# EAGLE design multimeter (EAGLE 6.5.0)
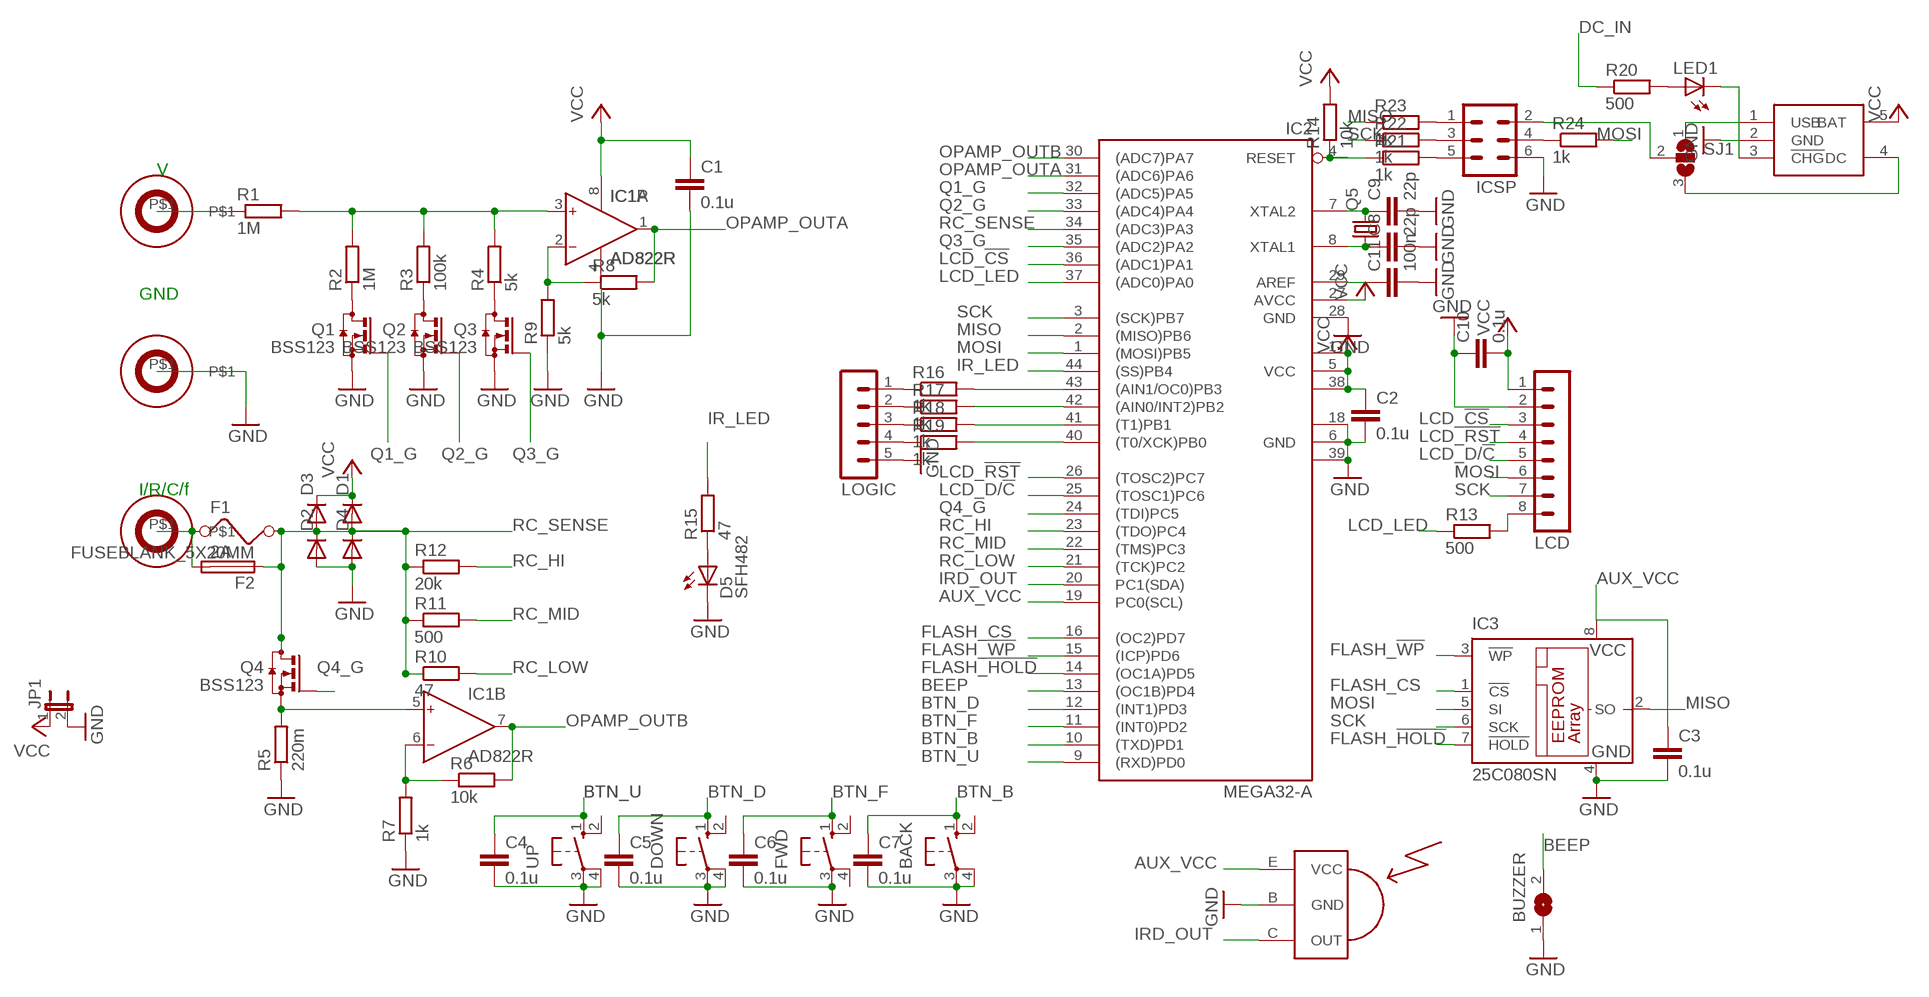
[diagram p0: schematic, sheet 1]

## Parts
BACK  10-XX  [B3F-10XX]
BUZZER  SJW  [SJW]
C1  0.1u  C-EUC0805  [C0805]
C2  0.1u  C-EUC0805  [C0805]
C3  0.1u  C-EUC0805  [C0805]
C4  0.1u  C-EUC0805  [C0805]
C5  0.1u  C-EUC0805  [C0805]
C6  0.1u  C-EUC0805  [C0805]
C7  0.1u  C-EUC0805  [C0805]
C8  22p  C-EUC0603  [C0603]
C9  22p  C-EUC0603  [C0603]
C10  0.1u  C-EUC0805  [C0805]
C11  100n  C-EUC0805  [C0805]
D1  DIODE-SOD123  [SOD123]
D2  DIODE-SOD123  [SOD123]
D3  DIODE-SOD123  [SOD123]
D4  DIODE-SOD123  [SOD123]
D5  SFH482  [SFH482]
DOWN  10-XX  [B3F-10XX]
F1  2A  FUSE'1206'  [R1206]
F2  FUSEBLANK_5X20MM  [FUSE_HOLDER_5X20MM]
FWD  10-XX  [B3F-10XX]
IC1  AD822R  [SO8]
IC2  MEGA32-A  [TQFP44]
IC3  25C080SN  [SO-08]
ICSP  MA03-2  [MA03-2]
JP1  JP1E  [JP1]
LCD  MA08-1  [MA08-1]
LED1  LEDSML0805  [SML0805]
LOGIC  MA05-1  [MA05-1]
N$36  BINDINGPOST4MMPCB  [BINDINGPOSTPCB]
Q1  BSS123  [SOT23]
Q2  BSS123  [SOT23]
Q3  BSS123  [SOT23]
Q4  BSS123  [SOT23]
Q5  CRYSTALHC49UP  [HC49UP]
R1  1M  R-EU_0207/12  [0207/12]
R2  1M  R-EU_R0805  [R0805]
R3  100k  R-EU_R0805  [R0805]
R4  5k  R-EU_R0805  [R0805]
R5  220m  R-EU_R1206  [R1206]
R6  10k  R-EU_R0805  [R0805]
R7  1k  R-EU_R0805  [R0805]
R8  5k  R-EU_R0805  [R0805]
R9  5k  R-EU_R0805  [R0805]
R10  47  R-EU_R0805  [R0805]
R11  500  R-EU_R0805  [R0805]
R12  20k  R-EU_R0805  [R0805]
R13  500  R-EU_R0805  [R0805]
R14  10k  R-EU_R0805  [R0805]
R15  47  R-EU_R0805  [R0805]
R16  1k  R-EU_R0805  [R0805]
R17  1k  R-EU_R0805  [R0805]
R18  1k  R-EU_R0805  [R0805]
R19  1k  R-EU_R0805  [R0805]
R20  500  R-EU_R0805  [R0805]
R21  1k  R-EU_R0805  [R0805]
R22  1k  R-EU_R0805  [R0805]
R23  1k  R-EU_R0805  [R0805]
R24  1k  R-EU_R0805  [R0805]
SJ1  SJ2W  [SJ_2]
U$1  BINDINGPOST4MMPCB  [BINDINGPOSTPCB]
U$2  BINDINGPOST4MMPCB  [BINDINGPOSTPCB]
U$3  IRDETECTOR  [TO92-EBC]
U$4  LITHIUMCHARGER  [SOT23-5L]
UP  10-XX  [B3F-10XX]

## Nets
AUX_VCC: C3.1 IC2.19(PC0(SCL)) IC3.8(VCC) U$3.E(VCC)
BEEP: BUZZER.2 IC2.13((OC1B)PD4)
BTN_B: BACK.1(S) C7.1 IC2.10((TXD)PD1)
BTN_D: C5.1 DOWN.1(S) IC2.12((INT1)PD3)
BTN_F: C6.1 FWD.1(S) IC2.11((INT0)PD2)
BTN_U: C4.1 IC2.9((RXD)PD0) UP.1(S)
DC_IN: ICSP.2 R20.1 SJ1.2
FLASH_!HOLD: IC2.14((OC1A)PD5) IC3.7(!HOLD)
FLASH_!WP: IC2.15((ICP)PD6) IC3.3(!WP)
FLASH_CS: IC2.16((OC2)PD7) IC3.1(!CS)
GND: BACK.3(P) BACK.4(P1) BUZZER.1 C1.2 C2.2 C3.2 C4.2 C5.2 C6.2 C7.2 C8.2 C9.2 C10.1 C11.2 D2.A D4.A D5.K(C) DOWN.3(P) DOWN.4(P1) FWD.3(P) IC1.4(P:V-) IC2.6(GND) IC2.18(GND1) IC2.28(GND) IC2.39(GND2) IC3.4(GND) ICSP.6 JP1.2 LCD.2 LOGIC.5 Q1.2(S) Q2.2(S) Q3.2(S) R5.1 R7.1 R9.1 U$2.P$1 U$3.B(GND) U$4.2(GND) UP.3(P) UP.4(P1)
IR_LED: IC2.44((SS)PB4) R15.2
IRD_OUT: IC2.20(PC1(SDA)) U$3.C(OUT)
LCD_!CS: IC2.36((ADC1)PA1) LCD.3
LCD_!RST: IC2.26((TOSC2)PC7) LCD.4
LCD_D/!C: IC2.25((TOSC1)PC6) LCD.5
LCD_LED: IC2.37((ADC0)PA0) R13.1
MISO: IC2.2((MISO)PB6) IC3.2(SO) R23.1
MOSI: IC2.1((MOSI)PB5) IC3.5(SI) LCD.6 R24.2
N$1: D5.A R15.1
N$2: Q2.3(D) R3.1
N$3: LOGIC.1 R16.1
N$4: IC1.3(A:IN+) R1.2 R2.2 R3.2 R4.2
N$5: IC1.5(B:IN+) Q4.2(S) R5.2
N$6: LOGIC.2 R17.1
N$7: IC1.6(B:IN-) R6.1 R7.2
N$8: LOGIC.3 R18.1
N$9: IC1.2(A:IN-) R8.1 R9.2
N$10: LOGIC.4 R19.1
N$11: IC2.43((AIN1/OC0)PB3) R16.2
N$12: ICSP.4 R24.1
N$13: IC2.42((AIN0/INT2)PB2) R17.2
N$14: IC2.41((T1)PB1) R18.2
N$15: IC2.40((T0/XCK)PB0) R19.2
N$16: C9.1 IC2.7(XTAL2) Q5.2
N$17: R1.1 U$1.P$1
N$18: C8.1 IC2.8(XTAL1) Q5.1
N$20: SJ1.3 U$4.4(DC)
N$21: IC2.4(RESET) R14.1 R21.1
N$22: SJ1.1 U$4.1(USB)
N$23: LED1.A R20.2
N$24: LED1.C U$4.3(!CHG)
N$25: ICSP.5 R21.2
N$26: ICSP.3 R22.2
N$27: ICSP.1 R23.2
N$28: C11.1 IC2.29(AREF)
N$34: LCD.8 R13.2
N$36: F1.1 F2.2 N$36.P$1
N$40: Q1.3(D) R2.1
N$43: Q3.3(D) R4.1
OPAMP_OUTA: IC1.1(A:OUT) IC2.31((ADC6)PA6) R8.2
OPAMP_OUTB: IC1.7(B:OUT) IC2.30((ADC7)PA7) R6.2
Q1_G: IC2.32((ADC5)PA5) Q1.1(G)
Q2_G: IC2.33((ADC4)PA4) Q2.1(G)
Q3_G: IC2.35((ADC2)PA2) Q3.1(G)
Q4_G: IC2.24((TDI)PC5) Q4.1(G)
RC_HI: IC2.23((TDO)PC4) R12.2
RC_LOW: IC2.21((TCK)PC2) R10.2
RC_MID: IC2.22((TMS)PC3) R11.2
RC_SENSE: D1.A D2.C D3.A D4.C F1.2 F2.1 IC2.34((ADC3)PA3) Q4.3(D) R10.1 R11.1 R12.1
SCK: IC2.3((SCK)PB7) IC3.6(SCK) LCD.7 R22.1
VCC: C1.1 C2.1 C10.2 D1.C D3.C IC1.8(P:V+) IC2.5(VCC) IC2.17(VCC1) IC2.27(AVCC) IC2.38(VCC2) JP1.1 LCD.1 R14.2 U$4.5(BAT)
Unconnected: BACK.2(S1) DOWN.2(S1) FWD.2(S1) FWD.4(P1) UP.2(S1)

## Notes on the sheet
- V
- GND
- I/R/C/f

## Library data of the parts
BACK DOWN FWD UP = switch-omron:10-XX: OMRON SWITCH; MPN: B3F-1000; OC_FARNELL: 176432; OC_NEWARK: 36M3542
BUZZER = jumper:SJ: SMD solder JUMPER
C1-C11 = rcl:C-EU: CAPACITOR, European symbol
D1-D4 = diode:DIODE-: DIODE
D5 = led:SFH482: IR LED infrared emitting diode, Infineon
F1 = myparts:FUSE: FUSE 5 x 20 mm
F2 = fuse:FUSE: Fuse; OC_FARNELL: unknown; OC_NEWARK: unknown
IC1 = analog-devices:AD822: Single-Supply, Rail-to-Rail Low Power FET-Input Op Amp Source: http://www.analog.com/static/imported-files/data_sheets/AD822.pdf; MF: ANALOG DEVICES; MPN: AD822BRZ; OC_FARNELL: 1651303
IC2 = atmel:MEGA32: MICROCONTROLLER 32 Kbytes FLASH 2 Kbytes SRAM 1 Kbytes EEPROM USART 8-channel 10 bit ADC Source: www.atmel.com .. doc2503.pdf; MPN: ATMEGA32-16AU; OC_FARNELL: 9171274; OC_NEWARK: 69K6677
IC3 = microchip:25*: Serial EEPROM 4K/ 8K , SPI bus; MF: MICROCHIP; MPN: 25C080/SN; OC_FARNELL: unknown; OC_NEWARK: 96K4086
ICSP = con-lstb:MA03-2: PIN HEADER; OC_FARNELL: unknown; OC_NEWARK: unknown
JP1 = jumper:JP1E: JUMPER
LCD = con-lstb:MA08-1: PIN HEADER; OC_FARNELL: unknown; OC_NEWARK: unknown
LED1 = led:LED: LED OSRAM: - CHIPLED LG R971, LG N971, LY N971, LG Q971, LY Q971, LO R971, LY R971 LH N974, LH R974 LS Q976, LO Q976, LY Q976 LO Q996 - Hyper CHIPLED LW Q18S LB Q993, LB Q99A, LB R99A - SideLED LS A670, LO A670, LY A670, LG A670, LP A670 LB A673, LV A673, LT A673, LW A673 LH A674 LY A675 LS A676, LA A676, LO A676, LY A676, LW A676 LS A679, LY A679, LG A679 - Hyper Micro SIDELED® LS Y876, LA Y876, LO Y876, LY Y876 LT Y87S - SmartLED LW L88C, LW L88S LB L89C, LB L89S, LG L890 LS L89K, LO L89K, LY L89K LS L896, LA L896, LO L896, LY L896 - TOPLED LS T670, LO T670, LY T670, LG T670, LP T670 LSG T670, LSP T670, LSY T670, LOP T670, LYG T670 LG T671, LOG T671, LSG T671 LB T673, LV T673, LT T673, LW T673 LH T674 LS T676, LA T676, LO T676, LY T676, LB T676, LH T676, LSB T676, LW T676 LB T67C, LV T67C, LT T67C, LS T67K, LO T67K, LY T67K, LW E67C LS E67B, LA E67B, LO E67B, LY E67B, LB E67C, LV E67C, LT E67C LW T67C LS T679, LY T679, LG T679 LS T770, LO T770, LY T770, LG T770, LP T770 LB T773, LV T773, LT T773, LW T773 LH T774 LS E675, LA E675, LY E675, LS T675 LS T776, LA T776, LO T776, LY T776, LB T776 LHGB T686 LT T68C, LB T68C - Hyper Mini TOPLED® LB M676 - Mini TOPLED Santana® LG M470 LS M47K, LO M47K, LY M47K Source: http://www.osram.convergy.de LUXEON: - LUMILED® LXK2-PW12-R00, LXK2-PW12-S00, LXK2-PW14-U00, LXK2-PW14-V00 LXK2-PM12-R00, LXK2-PM12-S00, LXK2-PM14-U00 LXK2-PE12-Q00, LXK2-PE12-R00, LXK2-PE12-S00, LXK2-PE14-T00, LXK2-PE14-U00 LXK2-PB12-K00, LXK2-PB12-L00, LXK2-PB12-M00, LXK2-PB14-N00, LXK2-PB14-P00, LXK2-PB14-Q00 LXK2-PR12-L00, LXK2-PR12-M00, LXK2-PR14-Q00, LXK2-PR14-R00 LXK2-PD12-Q00, LXK2-PD12-R00, LXK2-PD12-S00 LXK2-PH12-R00, LXK2-PH12-S00 LXK2-PL12-P00, LXK2-PL12-Q00, LXK2-PL12-R00 Source: www.luxeon.com KINGBRIGHT: KA-3528ASYC Source: www.kingbright.com
LOGIC = con-lstb:MA05-1: PIN HEADER; OC_FARNELL: unknown; OC_NEWARK: unknown
N$36 U$1 U$2 = myparts:BINDINGPOST
Q1-Q4 = transistor-small-signal:BSS123: N-CHANNEL MOS FET
Q5 = crystal:CRYSTAL: CRYSTAL; OC_FARNELL: unknown; OC_NEWARK: unknown
R1 R6-R24 = rcl:R-EU_: RESISTOR, European symbol
R2-R5 = resistor:R-EU_: RESISTOR, European symbol
SJ1 = jumper:SJ2W: SMD solder JUMPER
U$3 = myparts:IRDETECTOR
U$4 = myparts:LITHIUMCHARGER

## Board
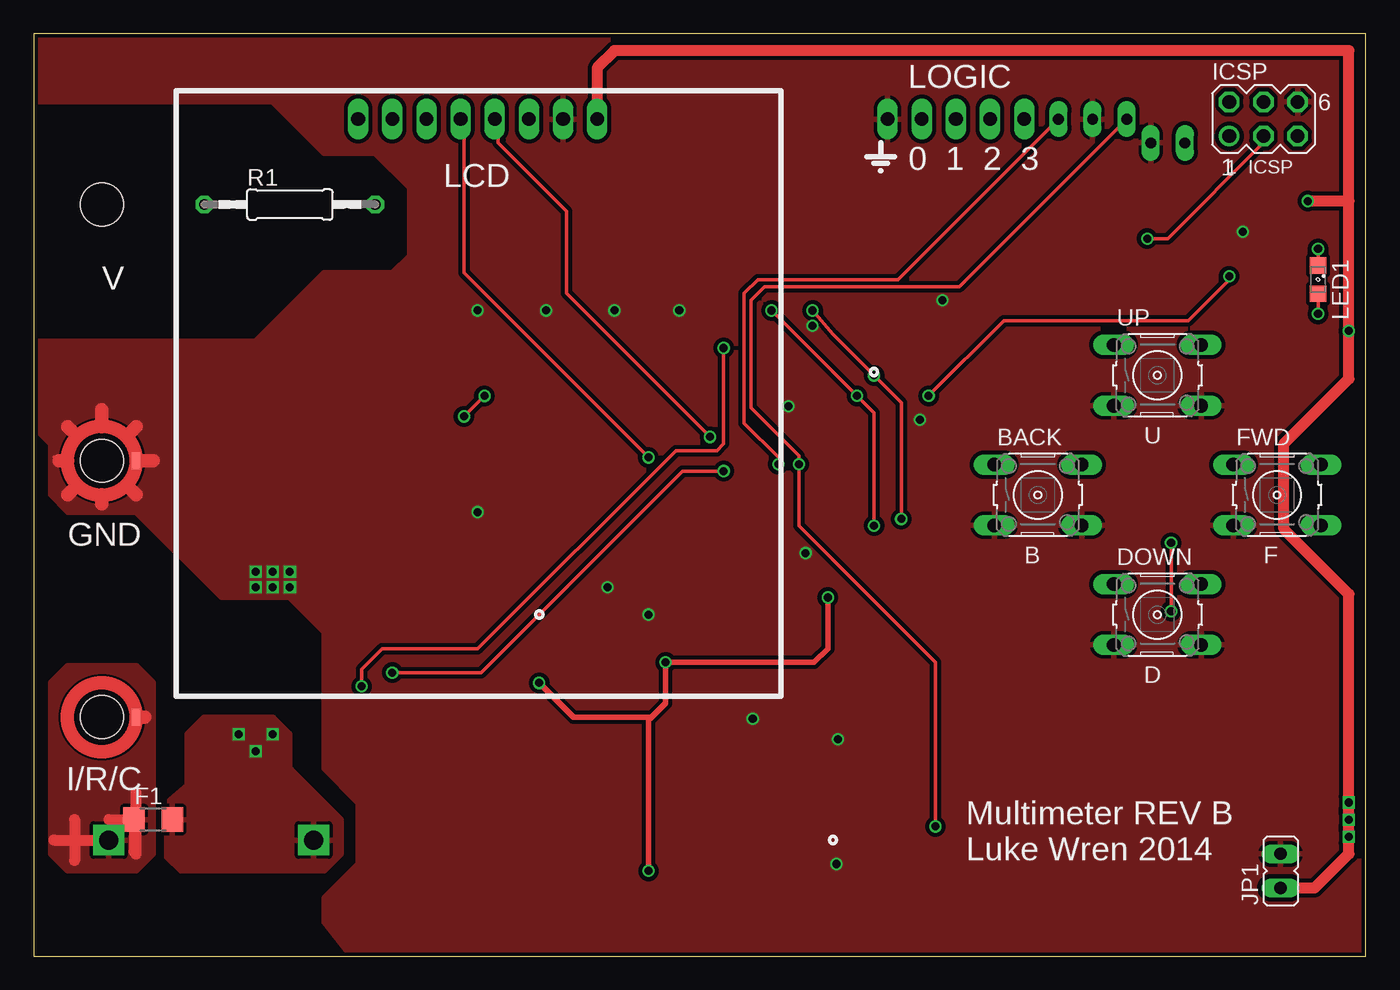
[diagram p1: board, top side]
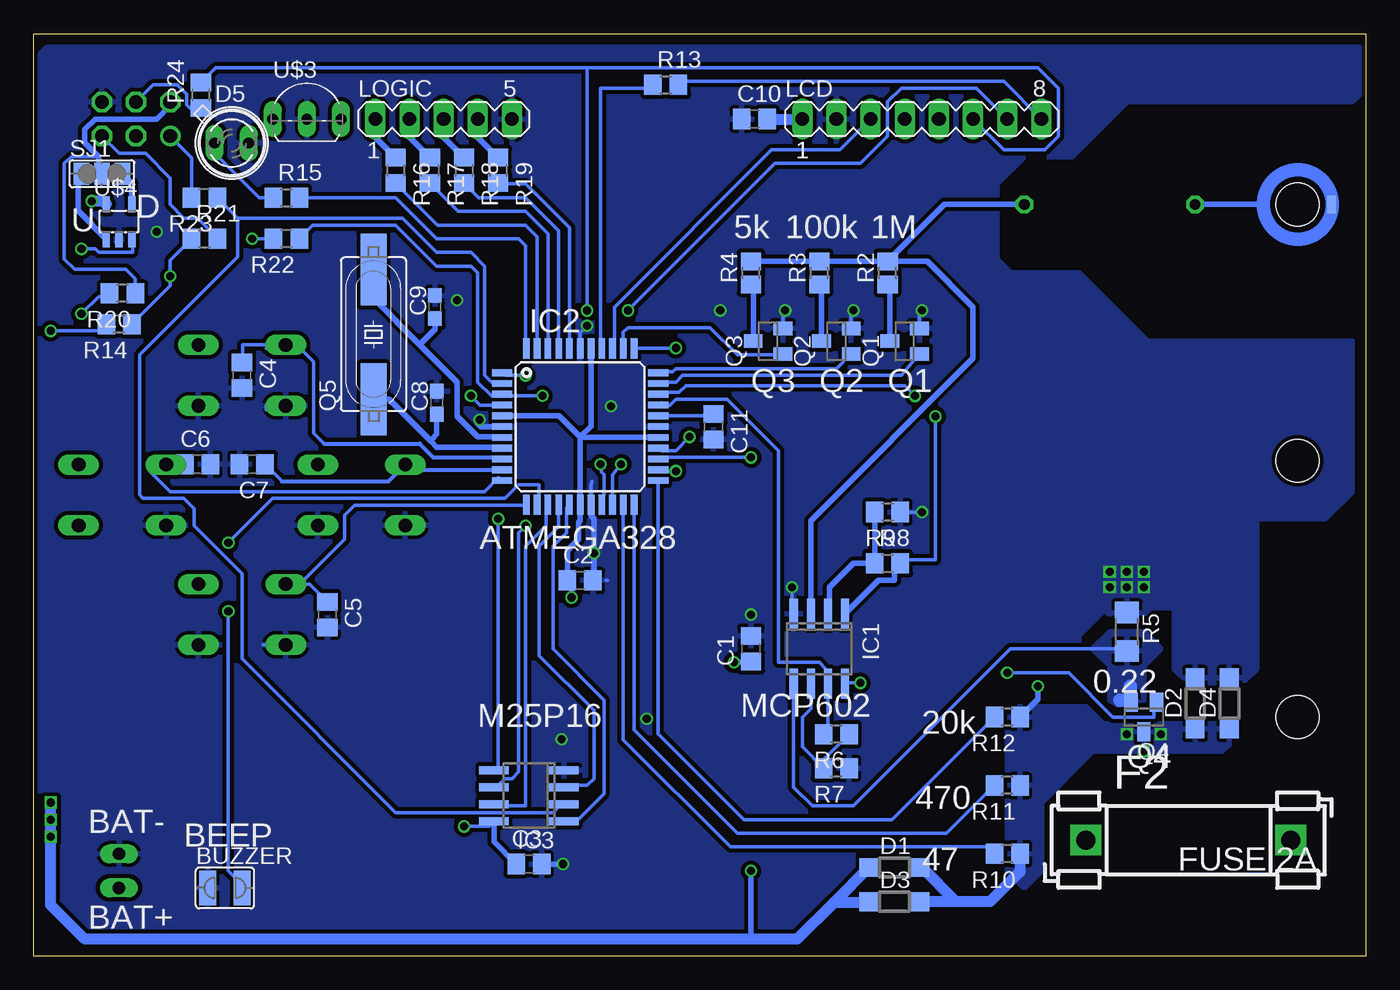
[diagram p2: board, bottom side, seen from below]

Size 99.06 x 68.58 mm. Coordinates in mm from the lower left corner, seen from the top.
Outline: 0,0 99.06,0 99.06,68.58 0,68.58 0,0
Copper layers (1*16): Top 0.035mm / dielectric 1.5mm / Bottom 0.035mm
Design rules "ITEADstudio_DRC": minimum track width 6mil, minimum drill 12mil, track to track 6mil, track to pad 6mil, pad to pad 6mil, via to via 6mil, smd to smd 0mil, copper to edge 10mil, drill to drill 10mil, minimum pad ring 10mil, minimum via ring 6mil, stop-mask expansion 2mil, vias tented up to drill 100mil, thermal gap 10mil
Holes 3.2 mm at 5.08,55.88 5.08,36.83 5.08,17.78

### Footprints (pad centres in the part's own frame; a part is rotated, then mirrored left to right if it is on the bottom)
B3F-10XX = drill 1.016 long: 1 -3.251,2.261; 2 3.251,2.261; 3 -3.251,-2.261; 4 3.251,-2.261
SJW = smd 1.27 x 2.54: 1 -1.27,0; 2 1.27,0
C0805 = smd 1.3 x 1.5: 1 -0.95,0; 2 0.95,0
C0603 = smd 1.1 x 1: 1 -0.85,0; 2 0.85,0
SOD123 = smd 1.4 x 1.4: A 1.9,0; C -1.9,0
SFH482 = drill 0.813 long: A -1.27,0; K 1.27,0
R1206 = smd 1.6 x 1.803: 1 -1.422,0; 2 1.422,0
FUSE_HOLDER_5X20MM = drill 1.422 pad 2.286 square: 1 0,0; 2 15.24,0
SO8 = smd 0.6 x 2.2: 1 -1.905,-2.6; 2 -0.635,-2.6; 3 0.635,-2.6; 4 1.905,-2.6; 5 1.905,2.6; 6 0.635,2.6; 7 -0.635,2.6; 8 -1.905,2.6
TQFP44 = smd 1.5 x 0.5: 1 -5.8,4; 2 -5.8,3.2; 3 -5.8,2.4; 4 -5.8,1.6; 5 -5.8,0.8; 6 -5.8,0; 7 -5.8,-0.8; 8 -5.8,-1.6; 9 -5.8,-2.4; 10 -5.8,-3.2; 11 -5.8,-4; 23 5.8,-4; 24 5.8,-3.2; 25 5.8,-2.4; 26 5.8,-1.6; 27 5.8,-0.8; 28 5.8,0; 29 5.8,0.8; 30 5.8,1.6; 31 5.8,2.4; 32 5.8,3.2; 33 5.8,4 | smd 0.5 x 1.5: 12 -4,-5.8; 13 -3.2,-5.8; 14 -2.4,-5.8; 15 -1.6,-5.8; 16 -0.8,-5.8; 17 0,-5.8; 18 0.8,-5.8; 19 1.6,-5.8; 20 2.4,-5.8; 21 3.2,-5.8; 22 4,-5.8; 34 4,5.8; 35 3.2,5.8; 36 2.4,5.8; 37 1.6,5.8; 38 0.8,5.8; 39 0,5.8; 40 -0.8,5.8; 41 -1.6,5.8; 42 -2.4,5.8; 43 -3.2,5.8; 44 -4,5.8
SO-08 = smd 0.6 x 2.2: 1 -1.905,-2.6; 2 -0.635,-2.6; 3 0.635,-2.6; 4 1.905,-2.6; 5 1.905,2.6; 6 0.635,2.6; 7 -0.635,2.6; 8 -1.905,2.6
MA03-2 = drill 1.016: 1 -2.54,-1.27 | drill 1.016 octagon: 2 -2.54,1.27; 3 0,-1.27; 4 0,1.27; 5 2.54,-1.27; 6 2.54,1.27
JP1 = drill 0.914 long: 1 0,-1.27; 2 0,1.27
MA08-1 = drill 1.016 long: 1 -8.89,0; 2 -6.35,0; 3 -3.81,0; 4 -1.27,0; 5 1.27,0; 6 3.81,0; 7 6.35,0; 8 8.89,0
SML0805 = smd 1.2 x 1.2: A 1.05,0; C -1.05,0
MA05-1 = drill 1.016 long: 1 -5.08,0; 2 -2.54,0; 3 0,0; 4 2.54,0; 5 5.08,0
BINDINGPOSTPCB = smd 0.635 x 1.27: P$1 2.54,0
SOT23 = smd 1 x 1.4: 1 -0.95,-1.1; 2 0.95,-1.1; 3 0,1.1
HC49UP = smd 5.334 x 1.93: 1 -4.826,0; 2 4.826,0
0207/12 = drill 0.813 octagon: 1 -6.35,0; 2 6.35,0
R0805 = smd 1.3 x 1.5: 1 -0.85,0; 2 0.85,0
R0805' = smd 1.3 x 1.5: 1 -0.95,0; 2 0.95,0
SJ_2 = smd 1.168 x 1.6: 1 -1.524,0; 2 0,0; 3 1.524,0
TO92-EBC = drill 0.813 long: B 0,-1.27; C 2.54,-1.27; E -2.54,-1.27
SOT23-5L = smd 0.55 x 1.2: 1 -0.95,-1.3; 2 0,-1.3; 3 0.95,-1.3; 4 0.95,1.3; 5 -0.95,1.3

### Placement (x,y rotation side)
BACK  74.68,34.29 0 top
BUZZER  84.84,5.08 0 bottom
C1  45.72,22.86 90 bottom
C2  58.42,27.94 0 bottom
C3  62.23,6.86 0 bottom
C4  83.57,43.18 270 bottom
C5  77.22,25.4 270 bottom
C6  86.87,36.58 0 bottom
C7  82.8,36.58 180 bottom
C8  69.09,41.15 90 bottom
C9  69.22,48.26 90 bottom
C10  45.47,62.23 0 bottom
C11  48.51,39.37 270 bottom
D1  35.05,6.6 0 bottom
D2  12.7,18.8 90 bottom
D3  35.05,4.06 0 bottom
D4  10.16,18.8 90 bottom
D5  84.33,60.45 0 bottom
DOWN  83.57,25.4 0 top
F1  8.89,10.16 0 top
F2  20.83,8.64 0 bottom
FWD  92.46,34.29 0 top
IC1  40.64,22.86 180 bottom
IC2  58.42,39.37 0 bottom
IC3  62.23,11.94 90 bottom
ICSP  91.44,62.23 0 top
JP1  92.71,6.35 0 top
LCD  33.02,62.23 0 bottom
LED1  95.5,50.29 270 top
LOGIC  68.58,62.23 0 bottom
N$36  5.08,17.78 0 top
Q1  34.29,45.72 90 bottom
Q2  39.37,45.72 90 bottom
Q3  44.45,45.72 90 bottom
Q4  16.51,17.78 180 bottom
Q5  73.79,46.23 90 bottom
R1  19.05,55.88 0 top
R2  35.56,50.8 90 bottom
R3  40.64,50.8 90 bottom
R4  45.72,50.8 90 bottom
R5  17.78,24.13 270 bottom
R6  10k  [R0805']  39.37,16.51 180 bottom
R7  1k  [R0805']  39.37,13.97 180 bottom
R8  5k  [R0805']  35.56,29.21 0 bottom
R9  5k  [R0805']  35.56,33.02 180 bottom
R10  47  [R0805']  26.67,7.62 180 bottom
R11  500  [R0805']  26.67,12.7 180 bottom
R12  20k  [R0805']  26.67,17.78 180 bottom
R13  500  [R0805']  52.07,64.77 0 bottom
R14  10k  [R0805']  92.71,46.99 180 bottom
R15  47  [R0805']  80.26,56.39 0 bottom
R16  1k  [R0805']  72.14,58.42 270 bottom
R17  1k  [R0805']  69.6,58.42 270 bottom
R18  1k  [R0805']  67.06,58.42 270 bottom
R19  1k  [R0805']  64.52,58.42 270 bottom
R20  500  [R0805']  92.46,49.28 180 bottom
R21  1k  [R0805']  86.36,53.34 0 bottom
R22  1k  [R0805']  80.26,53.34 180 bottom
R23  1k  [R0805']  86.36,56.39 180 bottom
R24  1k  [R0805']  86.61,64.01 90 bottom
SJ1  93.98,58.17 0 bottom
U$1  5.08,55.88 0 bottom
U$2  5.08,36.83 0 top
U$3  78.74,63.5 0 bottom
U$4  92.71,54.61 0 bottom
UP  83.57,43.18 0 top

### Tracks (layer width: path | path; a pad name or v marks a point on that pad's centre or on a via)
AUX_VCC  (via drill 0.6)
  Top 0.254: U$3.E 68.83,49.78 54.36,49.78 53.34,48.77 53.34,40.77 56.9,37.21 v56.9,36.58 56.9,32 67.06,21.84 v67.06,9.65
  Bottom 0.254: v56.9,36.58 56.82,35.99 56.64,35.81 56.64,34.29 56.82,34.11 IC2.19 | IC3.8 65.21,9.65 v67.06,9.65
  Bottom 0.406: C3.1 64.83,8.51 IC3.8
BEEP  (via drill 0.61)
  Top 0.254: v84.58,25.65 v84.58,30.73
  Bottom 0.254: v84.58,25.65 84.58,6.35 83.31,5.08 BUZZER.2 | IC2.13 61.47,34.04 61.47,35.05 62.99,35.05 64.01,34.04 81.28,34.04 v84.58,30.73
BTN_B
  Bottom 0.254: 64.52,36.07 IC2.10 | C7.1 80.58,35.31
  Bottom 0.305: 80.58,35.31 72.67,35.31 BACK.1 71.04,36.17 IC2.10
BTN_D
  Bottom 0.254: IC2.12 62.48,33.53 75.18,33.53 75.95,32.77 75.95,30.99 79.27,27.66 | 79.27,27.66 DOWN.1 | C5.1 78.53,27.66 79.27,27.66
BTN_F
  Bottom 0.254: IC2.11 64.52,35.56 65.53,34.54 88.9,34.54 90.42,36.07 FWD.1 87.84,36.55 C6.1
BTN_U
  Bottom 0.254: 64.52,37.08 IC2.9 | C4.1 83.53,45.44 UP.1 81.79,45.21 79.25,45.21 78.23,44.2 78.23,38.86 77.47,38.1
  Bottom 0.305: 77.47,38.1 70.36,38.1 69.34,37.08 64.33,37.08 IC2.9
DC_IN
  Bottom 0.254: ICSP.2 88.9,63.25 | 94.23,58.67 SJ1.2 | SJ1.2 93.98,58.42 | SJ1.2 94.23,58.42 94.23,59.44 96.27,59.44 96.77,58.93 96.77,51.82 96.01,51.05 92.2,51.05 91.51,50.36 R20.1
  Bottom 0.406: 88.9,63.25 89.92,62.23 94.49,62.23 95.25,61.47 95.25,60.45 94.23,59.44 94.23,58.67
FLASH_!HOLD
  Bottom 0.254: IC2.14 60.96,33.53 60.96,32 62.48,30.48 62.48,11.18 64.52,11.18 IC3.7
FLASH_!WP
  Bottom 0.254: IC3.3 59.5,12.7 57.91,12.7 57.4,13.21 57.4,18.29 61.47,22.35 61.47,30.48 60.02,31.93 IC2.15
FLASH_CS
  Bottom 0.254: IC2.16 59.44,33.35 59.44,31.5 60.45,30.48 60.45,22.86 56.64,19.05 56.64,12.06 58.67,10.03 IC3.1
GND  (via drill 0.6)
  Top 0.254: 1.52,37.08 1.91,36.83
  Top 0.406: 3.17,34.92 5.08,34.29
  Top 1.016: U$2.P$1 8.89,36.83 | 3.17,34.92 2.54,34.29 | 5.08,34.29 5.08,33.66 | 7.62,34.29 6.99,34.92 | 6.99,38.73 7.62,39.37 | 5.08,39.37 5.08,40.64 | 3.17,38.73 2.54,39.37 | 1.91,36.83 2.54,36.83
  Bottom 0.254: 38.1,13.97 R7.1 | R9.1 v33.02,33.02 | v57.91,46.86 58.42,46.35 IC2.39 | v33.02,48.01 33.19,47.84 Q1.2 | v38.1,48.01 38.27,47.84 Q2.2 | v43.18,48.01 43.35,47.84 Q3.2 | C2.2 57.78,27.94 | 57.53,35.31 57.62,35.01 IC2.18 | IC1.4 42.67,25.59 v42.67,27.43 | 56.52,27.94 56.39,27.94 | UP.3 81.79,40.87 81.79,40.64 | DOWN.3 82,23.14 | U$4.2 92.93,53.09 92.96,53.09
  Bottom 0.406: v59.69,6.86 C3.2 | IC2.18 57.62,32.73 57.4,32.51 v57.4,29.97 57.4,28.01 C2.2 | IC2.6 65.79,39.37 66.04,39.62
  other vias: 16.51,27.43 17.78,27.43 19.05,27.43 65.91,39.88 56.13,40.89 16.51,28.57 17.78,28.57 19.05,28.57 45.72,25.4 53.47,17.65 59.82,16.13 67.56,48.77 48.01,48.01 89.92,53.85
  pour Top: 1.27,34.29 1.27,39.37 2.54,40.64 8.89,40.64 20.32,29.21 20.32,27.94 19.05,26.67 13.97,26.67 7.62,33.02 2.54,33.02
  pour Bottom: 16.51,25.4 19.05,25.4 20.32,26.67 20.32,27.94 19.05,29.21 16.51,29.21 15.24,27.94 15.24,26.67
  pour Top (isolate 0.305): 0,68.58 0,63.5 17.78,63.5 21.59,59.69 25.4,59.69 27.94,57.15 27.94,52.07 26.67,50.8 21.59,50.8 16.51,45.72 0,45.72 0,39.37 1.27,38.1 3.81,40.64 7.62,40.64 17.78,30.48 17.78,27.94 21.59,24.13 21.59,13.97 24.13,11.43 24.13,6.86 21.59,4.32 21.59,2.54 23.37,0.25 99.06,0 98.55,68.58
  pour Bottom (isolate 0.305): 1.02,63.5 17.78,63.5 21.84,59.44 25.4,59.44 27.43,57.4 27.43,51.82 26.42,50.8 21.34,50.8 16.26,45.72 1.02,45.72 1.02,34.54 3.05,32.51 8.13,32.51 8.13,21.34 9.14,20.32 13.21,20.32 14.22,21.34 14.22,25.91 19.3,25.91 21.34,23.88 21.34,20.32 27.94,20.32 29.46,18.8 29.46,3.05 32,0.51 98.04,0.51 98.55,1.02 98.55,67.06 98.04,67.56 0.51,67.56 0.51,64.01
IR_LED
  Bottom 0.254: 62.48,45.23 62.48,52.83 62.99,53.34 69.09,53.34 72.14,56.39 R15.2
  Bottom 0.406: 62.48,45.23 IC2.44
IRD_OUT  (via drill 0.6)
  Top 0.254: U$3.C 64.26,50.29 53.85,50.29 52.83,49.28 52.83,39.62 55.37,37.08 v55.37,36.58
  Bottom 0.254: IC2.20 56.02,35.8 v55.37,36.58
LCD_!CS
  Bottom 0.254: LCD.3 39.12,59.94 44.2,59.94 55.88,48.26 55.88,45.21 IC2.36
LCD_!RST  (via drill 0.61)
  Top 0.254: v50.29,38.61 39.62,49.28 39.62,55.37 34.54,60.45 34.54,61.98 LCD.4
  Bottom 0.254: v50.29,38.61 51.31,37.59 52.32,37.59 IC2.26
LCD_D/!C  (via drill 0.61)
  Top 0.254: v45.72,37.08 32,50.8 32,61.98 LCD.5
  Bottom 0.254: v45.72,37.08 52.32,37.08 IC2.25
LCD_LED
  Bottom 0.254: IC2.37 56.9,45.21 56.9,64.52 53.34,64.52 R13.1
MISO
  Bottom 0.254: IC2.2 64.52,42.67 65.02,42.67 65.53,43.18 65.53,51.31 66.55,52.32 69.09,52.32 71.63,54.86 83.89,54.86 | IC3.2 59.94,11.18 60.45,10.67 72.14,10.67 83.57,22.1 83.57,28.45 87.12,32 87.12,33.27 87.88,34.04 90.93,34.04 91.19,34.29 91.19,44.7 83.89,52 83.89,54.86 | 83.89,54.86 R23.1
MOSI  (via drill 0.61)
  Top 0.254: v64.52,32.51 64.52,41.15 v62.48,43.18 59.44,46.23 v57.91,48.01
  Bottom 0.254: v62.48,43.18 64.01,43.18 IC2.1 | v64.52,32.51 64.52,13.72 IC3.5 | LCD.6 26.92,59.94 23.88,59.94 22.86,60.96 22.86,64.52 24.38,66.04 57.91,66.04 | 57.91,66.04 v57.91,48.01 | 57.91,66.04 85.53,66.04 R24.2
N$1
  Bottom 0.254: R15.1 82.3,56.39 85.85,59.94 85.6,60.2 D5.A
N$2
  Bottom 0.406: R3.1 40.47,49.95 Q2.3
N$3
  Bottom 0.406: LOGIC.1 73.66,60.89 R16.1
N$4
  Bottom 0.406: R1.2 31.33,55.88 R2.2 R3.2 | R3.2 R4.2 | R3.2 32.6,51.65 29.21,48.26 29.21,44.45 41.27,32.38 IC1.3
N$5
  Bottom 0.254: R5.2 17.93,22.86 26.42,22.86 38.1,11.18 41.15,11.18 42.55,12.57 IC1.5
  Bottom 1.016: 17.53,18.8 17.53,19.05 | 17.53,19.05 17.53,20.07 | 17.53,19.05 18.29,19.05
  pour Bottom: 16.51,19.05 16.51,21.59 15.24,22.86 16.51,24.13 19.05,24.13 20.32,22.86 19.05,21.59 19.05,19.05 18.26,18.54 17.96,18.54 17.78,18.72 17.78,19.05
N$6
  Bottom 0.406: LOGIC.2 71.12,60.89 R17.1
N$7
  Bottom 0.254: R6.1 40.32,14.61 R7.2 41.91,15.56 41.91,17.78 41.27,18.41 IC1.6
N$8
  Bottom 0.406: LOGIC.3 68.58,60.89 R18.1
N$9
  Bottom 0.406: R9.2 R8.1 38.1,29.21 39.88,27.43 39.88,25.59 IC1.2
N$10
  Bottom 0.406: LOGIC.4 66.04,60.89 R19.1
N$11
  Bottom 0.254: IC2.43 61.62,53.49 62.48,54.36 69.02,54.36 R16.2
N$12
  Bottom 0.254: ICSP.4 90.17,64.77 88.39,64.77 87.7,64.07 87.7,63.31 87.38,62.99 86.68,62.99 R24.1
N$13
  Bottom 0.254: IC2.42 60.82,53.71 62.48,55.37 67.5,55.37 R17.2
N$14
  Bottom 0.254: 67.06,57.4 R18.2 65.97,56.39 62.48,56.39 60.02,53.92 IC2.41
N$15
  Bottom 0.254: IC2.40 59.22,54.14 62.48,57.4 64.45,57.4 R19.2
N$16
  Bottom 0.406: Q5.2 73.79,48.9 70.36,45.47 | 70.36,45.47 67.56,42.67 67.56,40.13 66.04,38.61 64.26,38.61 IC2.7 | C9.1 69.22,46.61 70.36,45.47
N$17
  Bottom 0.406: R1.1 7.62,55.88 7.62,57.15 6.35,58.42 3.81,58.42 2.54,57.15 U$1.P$1
N$18
  Bottom 0.406: C8.1 69.09,38.79 69.47,38.41 69.47,38.23 | IC2.8 64.3,37.85 69.09,37.85 69.47,38.23 | 69.47,38.23 72.64,41.4 Q5.1
N$20
  Bottom 0.406: SJ1.3 91.76,57.47 U$4.4
N$21  (via drill 0.6)
  Top 0.254: v66.55,41.66 72.14,47.24 85.85,47.24 88.9,50.29 v88.9,50.55
  Bottom 0.254: IC2.4 65.86,40.97 v66.55,41.66 | R21.1 88.9,51.75 v88.9,50.55 88.9,49.85 R14.1
N$22
  Bottom 0.406: U$4.1 95.76,55.41 95.76,57.66 95.5,57.91 SJ1.1
N$23  (via drill 0.6)
  Top 0.254: LED1.A v95.5,47.75
  Bottom 0.254: R20.2 93.66,49.02 94.23,49.02 v95.5,47.75
N$24  (via drill 0.6)
  Top 0.254: LED1.C v95.5,52.58
  Bottom 0.254: U$4.3 91.69,53.24 91.69,52.32 94.23,52.32 94.49,52.58 v95.5,52.58
N$25
  Bottom 0.254: ICSP.5 92.71,59.69 90.74,59.69 88.9,57.85 88.9,55.88 87.88,54.86 86.87,54.86 85.41,53.41 R21.2
N$26  (via drill 0.6)
  Top 0.254: ICSP.3 91.44,60.45 84.33,53.34 v82.8,53.34
  Bottom 0.254: R22.2 v82.8,53.34
N$27
  Bottom 0.254: R23.2 87.31,59.37 ICSP.1
N$28
  Bottom 0.254: C11.1 48.92,40.17 IC2.29
N$34
  Bottom 0.254: LCD.8 26.92,65.02 50.8,65.02 R13.2
N$36
  Top 0.254: 8.64,17.78 8.26,17.78
  Top 0.813: F1.1 7.47,7.77 7.62,7.62 7.62,12.19 | 5.59,10.16 7.11,10.16 | 1.52,8.64 4.57,8.64 | 3.05,10.16 3.05,7.11
  Top 1.016: N$36.P$1 8.26,17.78
  pour Top: 8.89,7.62 7.62,6.35 2.54,6.35 1.27,7.62 1.27,20.32 2.54,21.59 7.62,21.59 8.89,20.32
N$40
  Bottom 0.406: R2.1 35.39,49.95 Q1.3
N$43
  Bottom 0.406: R4.1 45.55,49.95 Q3.3
OPAMP_OUTA  (via drill 0.61)
  Top 0.254: v32,40.13 v33.53,41.66
  Bottom 0.254: v32,40.13 32,29.46 34.54,29.46 R8.2 | 52.32,41.66 IC2.31 52.51,41.66 52.25,41.91 51.05,41.91 50.55,42.42 34.29,42.42 v33.53,41.66
  Bottom 0.406: R8.2 35.05,28.77 35.05,27.94 36.26,27.94 IC1.1
OPAMP_OUTB
  Bottom 0.254: R6.2 40.01,16.82 IC1.7 40.13,20.32 40.13,21.34 40.64,21.84 43.69,21.84 43.69,37.59 47.5,41.4 51.31,41.4 51.74,40.97 IC2.30 52.32,41.15
Q1_G
  Bottom 0.254: Q1.1 34.53,43.18 50.8,43.18 51.31,42.67 52.52,42.67 IC2.32
Q2_G
  Bottom 0.254: Q2.1 39.35,43.69 51.31,43.69 51.56,43.43 52.56,43.43 IC2.33
Q3_G
  Bottom 0.254: 43.42,44.7 46.74,44.7 48.77,46.74 54.86,46.74 55.22,46.38 IC2.35
  Bottom 0.406: Q3.1 43.42,44.7
Q4_G  (via drill 0.6)
  Top 0.254: v51.31,36.07 48.26,36.07 33.27,21.08 v26.67,21.08
  Bottom 0.254: Q4.1 15.49,18.95 15.49,19.05 15.24,18.8 15.48,18.8 Q4.1 | IC2.24 52.52,36.07 v51.31,36.07 | Q4.1 15.75,18.69 15.75,17.78 18.8,17.78 22.1,21.08 v26.67,21.08
RC_HI
  Bottom 0.254: R12.2 35.24,10.16 46.23,10.16 52.62,16.55 IC2.23
RC_LOW
  Bottom 0.254: R10.2 28.13,8.13 47.24,8.13 55.22,16.1 IC2.21
RC_MID
  Bottom 0.254: R11.2 31.18,9.14 46.74,9.14 54.42,16.83 IC2.22
RC_SENSE  (via drill 0.6)
  Top 0.254: v24.38,20.07 24.38,21.34 25.91,22.86 33.02,22.86 47.75,37.59 50.8,37.59 51.31,38.1 v51.31,45.21
  Bottom 0.254: v51.31,45.21 54.38,45.21 IC2.34
  Bottom 0.406: R12.1 24.38,19.12 v24.38,20.07
  Bottom 0.813: R10.1 25.72,6.28 27.94,4.06 30.48,4.06 | 30.48,4.06 D3.A | D1.A 33.02,6.6 30.48,4.06
  other vias: 15.24,16.51 16.51,15.24 17.78,16.51
  pour Top: 9.91,7.37 9.91,11.43 11.43,12.7 11.43,16.51 12.7,17.78 17.78,17.78 19.05,16.51 19.05,13.97 22.86,10.16 22.86,7.62 21.59,6.35 10.92,6.35
  pour Bottom (isolate 0.305): 9.91,17.27 19.56,17.27 20.83,18.54 26.67,18.54 26.67,6.35 25.4,5.08 24.13,6.35 24.13,11.43 20.32,15.24 10.67,15.24 9.91,16
SCK  (via drill 0.6, 0.61)
  Top 0.254: v62.48,32 62.48,40.39 v61.21,41.66 v54.86,48.01
  Bottom 0.254: v62.48,32 62.99,31.5 62.99,13.72 63.5,13.21 64.01,13.21 64.52,12.7 IC3.6 | LCD.7 28.96,64.52 34.54,64.52 35.56,63.5 35.56,60.96 37.59,58.93 43.94,58.93 v54.86,48.01 | v61.21,41.66 64.01,41.66 IC2.3 64.52,41.66 65.02,41.66 66.04,42.67 66.04,50.8 66.55,51.31 69.09,51.31 72.14,54.36 78.3,54.36 R22.1
VCC  (via drill 0.6)
  Top 0.254: 45.72,17.78 45.85,17.65
  Top 0.406: v45.72,6.35 45.72,17.53 45.85,17.65 46.99,18.8 v46.99,21.84 58.04,21.84 59.05,22.86 v59.05,26.67 | 45.72,17.78 40.13,17.78 v37.59,20.32
  Top 0.813: JP1.1 95.25,5.08 97.79,7.62 v97.79,8.89 v97.79,10.16 v97.79,11.43 97.79,26.92 92.96,31.75 92.96,38.1 97.79,42.93 v97.79,46.48 97.79,56.13 | 97.79,56.13 97.79,67.31 43.18,67.31 41.91,66.04 LCD.1 | 97.79,56.13 v94.74,56.13
  Bottom 0.254: C2.1 59.21,27.78 | IC1.8 38.67,20.32 v37.59,20.32 | U$4.5 93.7,56.16 93.73,56.13 | R14.2 94.17,46.48 v97.79,46.48
  Bottom 0.406: C1.1 v46.99,21.84 | v45.72,6.35 45.72,1.27 | 58.42,38.61 IC2.17 58.42,32.38 58.55,32.26 58.55,30.99 59.37,30.16 C2.1 59.05,27.62 v59.05,26.67 59.05,26.8 | 58.42,38.61 58.38,38.57 IC2.27 | IC2.38 57.62,39.41 58.42,38.61 | 58.42,38.61 59.98,40.17 IC2.5
  Bottom 0.813: v97.79,11.43 v97.79,10.16 v97.79,8.89 97.79,3.81 95.25,1.27 45.72,1.27 42.29,1.27 39.56,4 | C10.2 LCD.1 | D1.C 39.56,4 | D3.C 37.02,4 39.56,4 | U$4.5 93.88,56.13 v94.74,56.13

### Text on the board
tPlace: LOGIC | 0 1 2 3 | 1 ICSP | LCD | V | U | GND | B | F | D | I/R/C | Multimeter REV B / Luke Wren 2014
bPlace: D | U | 1M | 100k | 5k | Q1 | Q2 | Q3 | ATMEGA328 | 0.22 | MCP602 | 20k | M25P16 | Q4 | 470 | BAT- | BEEP | FUSE 2A | 47 | BAT+